# EAGLE design MySens-easyESP32b-007c (EAGLE 7.7.0)
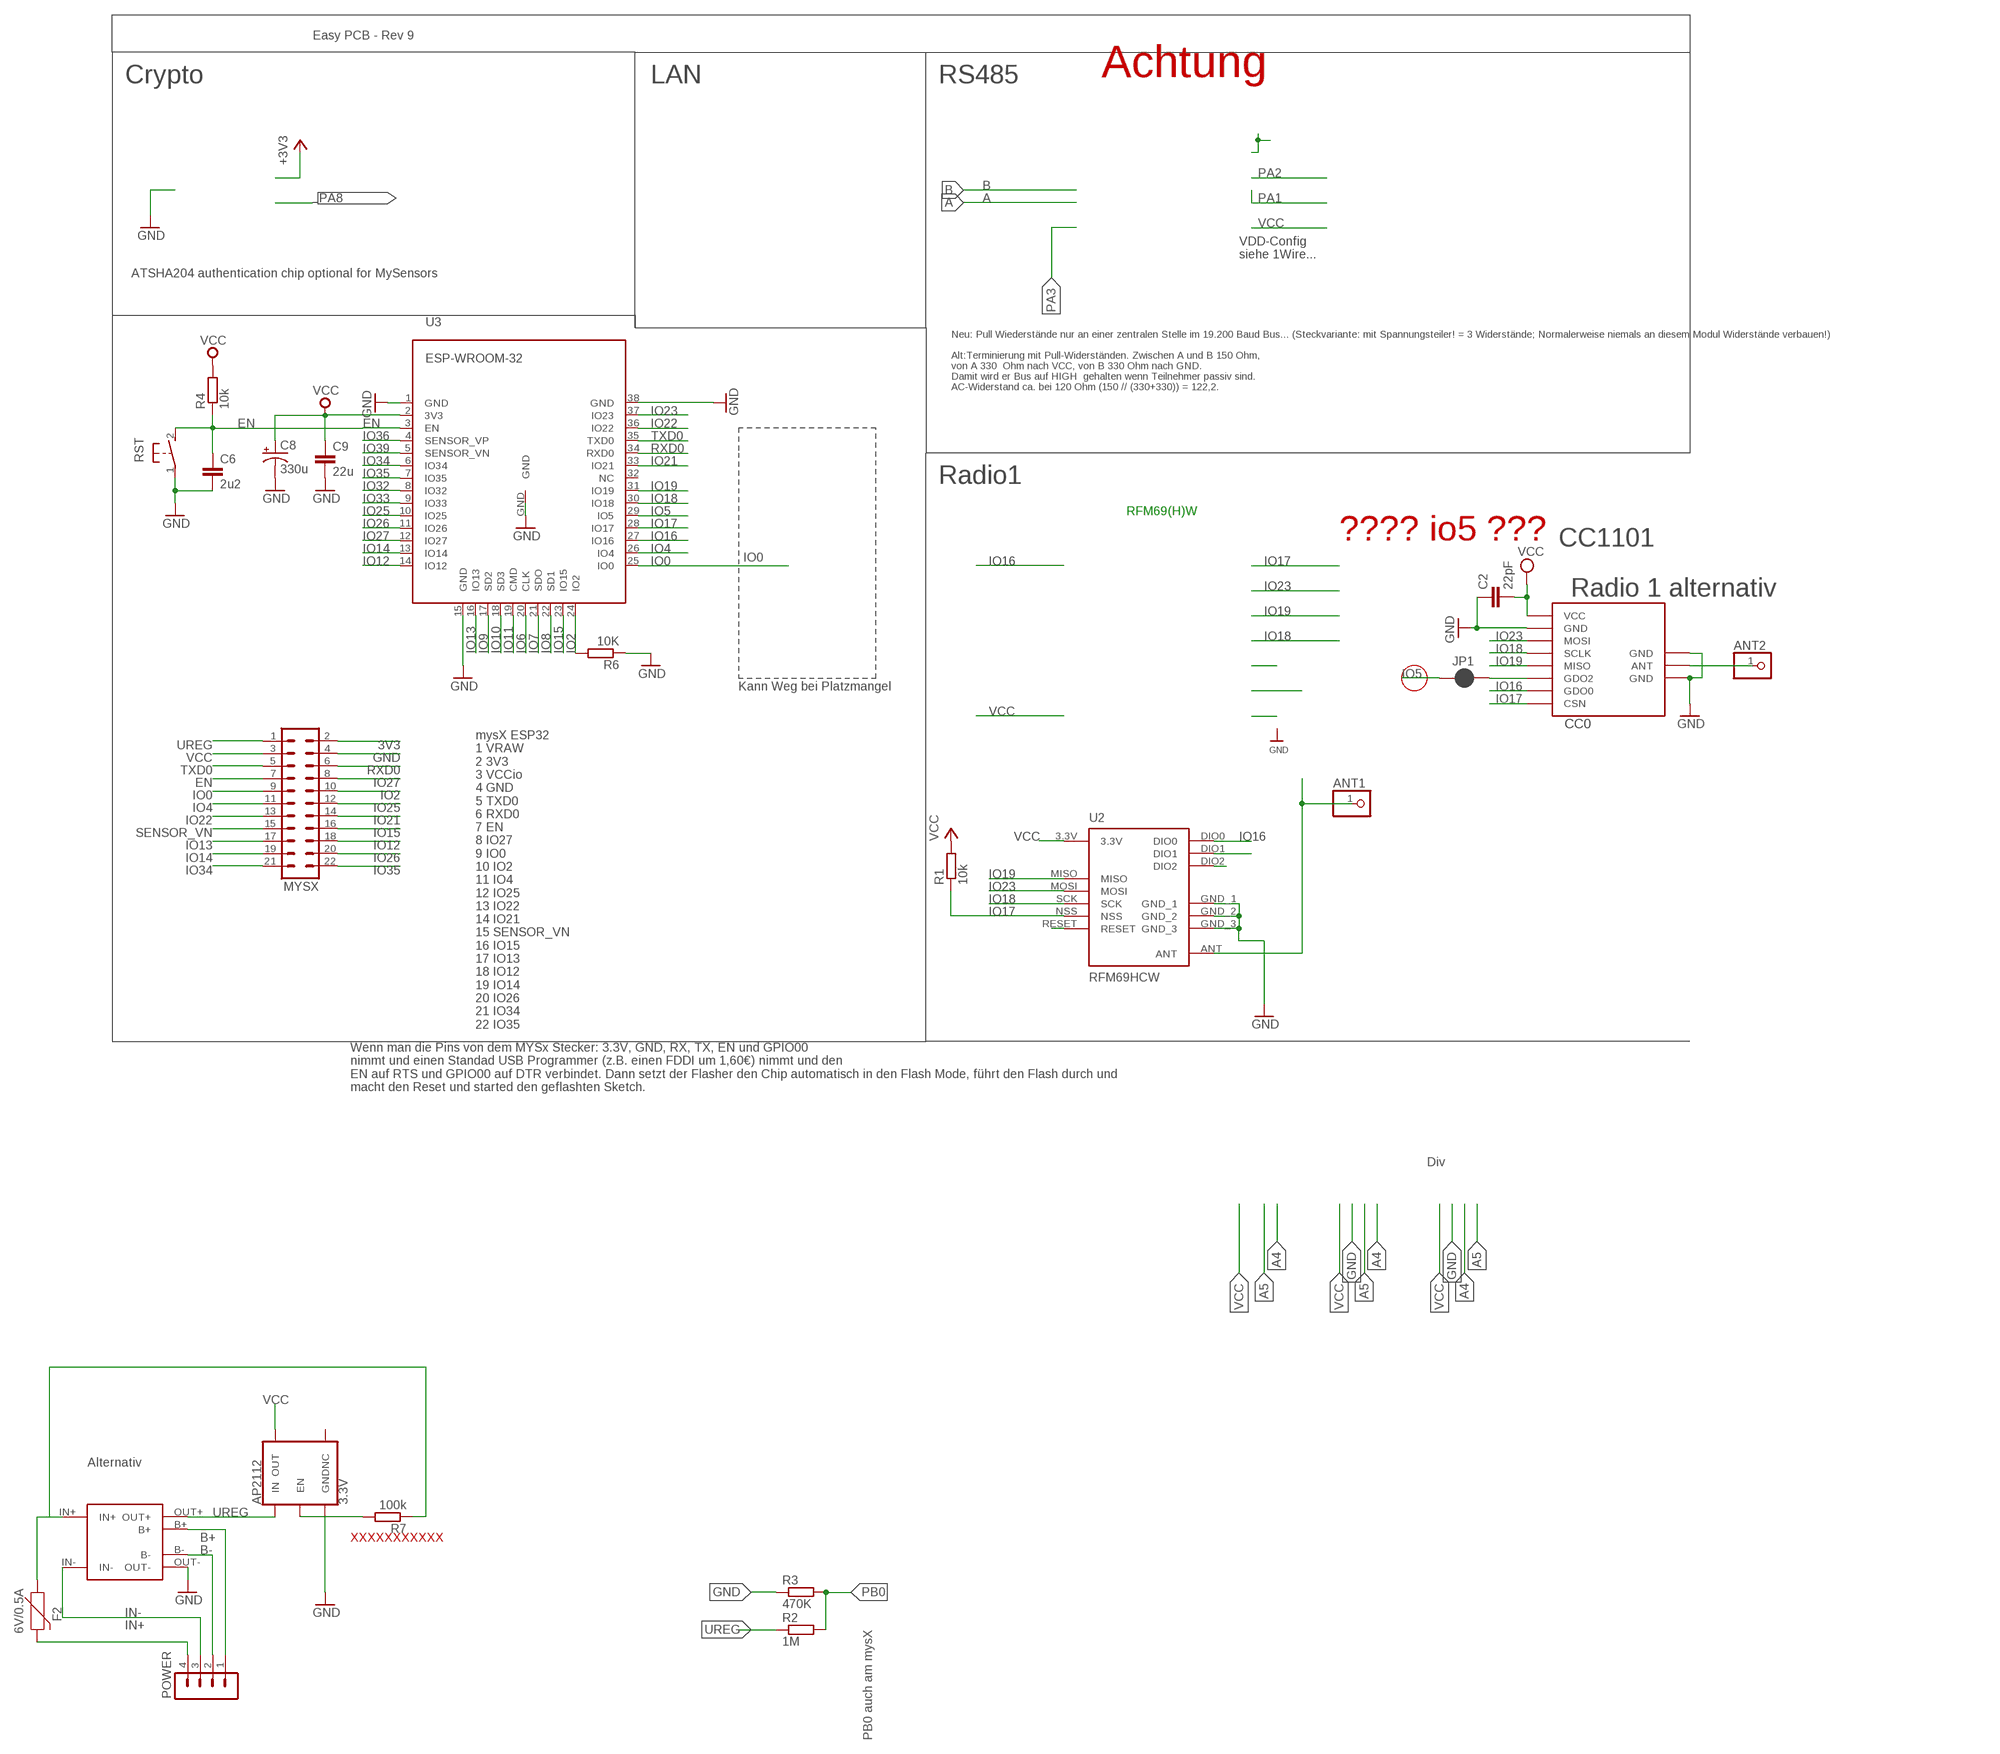
[diagram p0: schematic, sheet 1]

## Parts
ANT1  PINHD-1X1  [1X01]
ANT2  PINHD-1X1  [1X01]
AP2112  3.3V  V_REG_AP2112K-3.3V  [SOT23-5]
C2  22pF  C-EUC0805  [C0805]
C6  2u2  C-EUC0805  [C0805]
C8  330u  CAP_POLSMD  [VISHAY_C]
C9  22u  C-EUC0805  [C0805]
CC0  CC1101  CC1101_MODULE1SMD  [CC1101_MODULE1_SMD]
F2  6V/0.5A  PPTC_HALF-AMP  [1206]
JP1  JUMPER-SMT_2_NC_PASTE_NO-SILK  [SMT-JUMPER_2_NC_PASTE_NO-SILK]
MYSX  MA11-2  [MA11-2]
POWER  MA04-1  [MA04-1]
R1  10k  R-EU_M0805  [M0805]
R2  1M  R-EU_M0805  [M0805]
R3  470K  R-EU_M0805  [M0805]
R4  10k  R-EU_M0805  [M0805]
R6  10K  R-EU_M0805  [M0805]
R7  100k  R-EU_M0805  [M0805]
RST  DTSM-3  [DTSM-3]
TP4056  TP4056-MODULE  [TP4056-LITHIUM-PROTECTED-MODULE]
U2  RFM69HCW  [RFM69HCW-XXXS2]
U3  ESP-WROOM-32  [ESP-WROOM-32]

## Nets
3V3: MYSX.2 ; supply symbol labelled +3V3
ANT0: ANT2.1 CC0.ANT
ANT1: ANT1.1 U2.ANT
B+ [vcc]: POWER.1 TP4056.B+
B- [gnd]: POWER.2 TP4056.B-
EN: C6.1 MYSX.7 R4.1 RST.2 U3.3(EN)
GND [gnd]: AP2112.2(GND) C2.1 C6.2 C8.- C9.2 CC0.GND@0(GND) CC0.GND@1(GND) CC0.GND@2(GND) MYSX.4 R3.1 R6.1 RST.1 TP4056.OUT- U2.GND_1 U2.GND_2 U2.GND_3 U3.1(GND) U3.15(GND) U3.38(GND) U3.GND
IN+ [vcc]: F2.2 POWER.4
IN++ [vcc]: F2.1 R7.1 TP4056.IN+
IN- [gnd]: POWER.3 TP4056.IN-
IO0: MYSX.9 U3.25(IO0)
IO2: MYSX.10 R6.2 U3.24(IO2)
IO4: MYSX.11 U3.26(IO4)
IO5: JP1.1 U3.29(IO5)
IO6: U3.20(CLK)
IO7: U3.21(SDO)
IO8: U3.22(SD1)
IO9: U3.17(SD2)
IO10: U3.18(SD3)
IO11: U3.19(CMD)
IO12: MYSX.18 U3.14(IO12)
IO13: MYSX.17 U3.16(IO13)
IO14: MYSX.19 U3.13(IO14)
IO15: MYSX.16 U3.23(IO15)
IO16: CC0.GDO0 U2.DIO0 U3.27(IO16)
IO17: CC0.CSN R1.1 U2.NSS U3.28(IO17)
IO18: CC0.SCLK U2.SCK U3.30(IO18)
IO19: CC0.MISO U2.MISO U3.31(IO19)
IO21: MYSX.14 U3.33(IO21)
IO22: MYSX.13 U3.36(IO22)
IO23: CC0.MOSI U2.MOSI U3.37(IO23)
IO25: MYSX.12 U3.10(IO25)
IO26: MYSX.20 U3.11(IO26)
IO27: MYSX.8 U3.12(IO27)
IO32: U3.8(IO32)
IO33: U3.9(IO33)
IO34: MYSX.21 U3.6(IO34)
IO35: MYSX.22 U3.7(IO35)
IO36: U3.4(SENSOR_VP)
IO39: U3.5(SENSOR_VN)
MAYBE_IO5: CC0.GDO2 JP1.2
N$4: U2.DIO2
N$8: U2.DIO1
N$9: U2.RESET
N$12: AP2112.3(EN) R7.2
PB0: R2.2 R3.2
RXD0: MYSX.6 U3.34(RXD0)
SENSOR_VN: MYSX.15
TXD0: MYSX.5 U3.35(TXD0)
UREG [gnd]: AP2112.1(IN) MYSX.1 R2.1 TP4056.OUT+
VCC [gnd]: AP2112.5(OUT) C2.2 C8.+ C9.1 CC0.VCC MYSX.3 R1.2 R4.2 U2.3.3V U3.2(3V3)
Unconnected: AP2112.4(NC) U3.32(NC)

## Notes on the sheet
- Easy PCB - Rev 9
- Crypto | LAN | RS485 | Achtung
- VDD-Config
  siehe 1Wire...
- ATSHA204 authentication chip optional for MySensors
- Neu: Pull Wiederstände nur an einer zentralen Stelle im 19.200 Baud Bus... (Steckvariante: mit Spannungsteiler! = 3 Widerstände; Normalerweise niemals an diesem Modul Widerstände verbauen!)
  
  Alt:Terminierung mit Pull-Widerständen. Zwischen A und B 150 Ohm,
  von A 330  Ohm nach VCC, von B 330 Ohm nach GND. 
  Damit wird er Bus auf HIGH  gehalten wenn Teilnehmer passiv sind.
  AC-Widerstand ca. bei 120 Ohm (150 // (330+330)) = 122,2.
- Radio1
- RFM69(H)W
- ???? io5 ??? | CC1101
- Radio 1 alternativ
- Kann Weg bei Platzmangel
- mysX ESP32
  1 VRAW
  2 3V3
  3 VCCio
  4 GND
  5 TXD0
  6 RXD0
  7 EN
  8 IO27
  9 IO0
  10 IO2
  11 IO4
  12 IO25
  13 IO22
  14 IO21
  15 SENSOR_VN
  16 IO15
  17 IO13
  18 IO12
  19 IO14
  20 IO26
  21 IO34
  22 IO35
- Wenn man die Pins von dem MYSx Stecker: 3.3V, GND, RX, TX, EN und GPIO00
  nimmt und einen Standad USB Programmer (z.B. einen FDDI um 1,60€) nimmt und den
  EN auf RTS und GPIO00 auf DTR verbindet. Dann setzt der Flasher den Chip automatisch in den Flash Mode, führt den Flash durch und
  macht den Reset und started den geflashten Sketch.
- Div
- Alternativ
- XXXXXXXXXXX
- PB0 auch am mysX

## Library data of the parts
ANT1 ANT2 = pinhead:PINHD-1X1: PIN HEADER
AP2112 = SparkFun-IC-Power:V_REG_AP2112: AP2112 - 600mA CMOS LDO Regulator w/ Enable The AP2112 is CMOS process low dropout linear regulator with enable function, the regulator delivers a guaranteed 600mA (min.) continuous load current. Features Output Voltage Accuracy: ±1.5% Output Current: 600mA (Min.) Foldback Short Current Protection: 50mA Enable Function to Turn ON/OFF VOUT Low Dropout Voltage (3.3V): 250mV (Typ.) @IOUT=600mA Excellent Load Regulation: 0.2%/A (Typ.) Excellent Line Regulation: 0.02%/V (Typ.) Low Quiescent Current: 55μA (Typ.) Low Standby Current: 0.01μA (Typ.) Low Output Noise: 50μVRMS PSRR: 100Hz -65dB, 1kHz -65dB OTSD Protection Stable with 1.0μF Flexible Cap: Ceramic, Tantalum and Aluminum Electrolytic Operation Temperature Range: -40°C to 85°C ESD: MM 400V, HBM 4000V; PROD_ID: VREG-12457
C2 = rcl:C-EU: CAPACITOR, European symbol
C6 C9 = rcl@1:C-EU: CAPACITOR, European symbol; SPICEPREFIX: C
C8 = SparkFun-Passives:CAP_POL: Capacitor Polarized These are standard SMD and PTH capacitors. Normally 10uF, 47uF, and 100uF in electrolytic and tantalum varieties. Always verify the external diameter of the through hole cap, it varies with capacity, voltage, and manufacturer. The EIA devices should be standard.
CC0 = wireless:CC1101_MODULE1: CC1101 wireless module for 433/868 MHz (sold from Aliexpress). DIL version for mounting with pin header (and SMD soldering) and SMD only variant available.
F2 = SparkFun-Fuses:PPTC: Resettable Fuse PPTC Resettable Fuse. Really a sort of resistor with a polymeric positive temperature coefficient whose resistance increases dramatically with an increase in temperature. When heated by the power passing through the resistance rises causing the current to be limited, protecting the circuit. This is achieved by the transition of the polymer from a crystalline to an amorphous state where the conductive carbon separates breaking the conductive pathways found in the cool crystalline structure. When a PPTC cools back down it resumes conducting letting the circuit turn back on. SparkFun Products: SparkFun RedBoard - Programmed with Arduino <https://www.sparkfun.com/products/12757> Pro Micro - 5V/16MHz <https://www.sparkfun.com/products/12640> Arduino Pro 328 - 5V/16MHz <https://www.sparkfun.com/products/10915> MP3 Trigger <https://www.sparkfun.com/products/13720>; PROD_ID: RES-08585
JP1 = SparkFun-Jumpers:JUMPER-SMT_2_NC_PASTE: Normally closed solder jumper This jumper has an aperture in the stencil to allow solder paste to bridge the split in the wire so it's normally closed (NC). Wick off the solder to open the connection. Reapply solder to reclose the connection.
MYSX = con-Pinheader:MA11-2: PIN HEADER; OC_FARNELL: unknown; OC_NEWARK: unknown
POWER = con-lstb:MA04-1: PIN HEADER; OC_FARNELL: unknown; OC_NEWARK: unknown
R1-R3 R6 R7 = rcl:R-EU_: RESISTOR, European symbol
R4 = rcl@1:R-EU_: RESISTOR, European symbol; SPICEPREFIX: R
RST = switch-tact:DTSM-3
TP4056 = tp2112-usw-V2:TP4056-MODULE
U2 = doug:RFM69H
U3 = esp32:ESP-WROOM-32

## Net classes
0 default: width 0.305 mm, clearance 0.205 mm
1 gnd: width 0.457 mm, drill 0.635 mm, clearance 0.254 mm
2 vcc: width 0.406 mm, drill 0.406 mm, clearance 0.254 mm

## Board
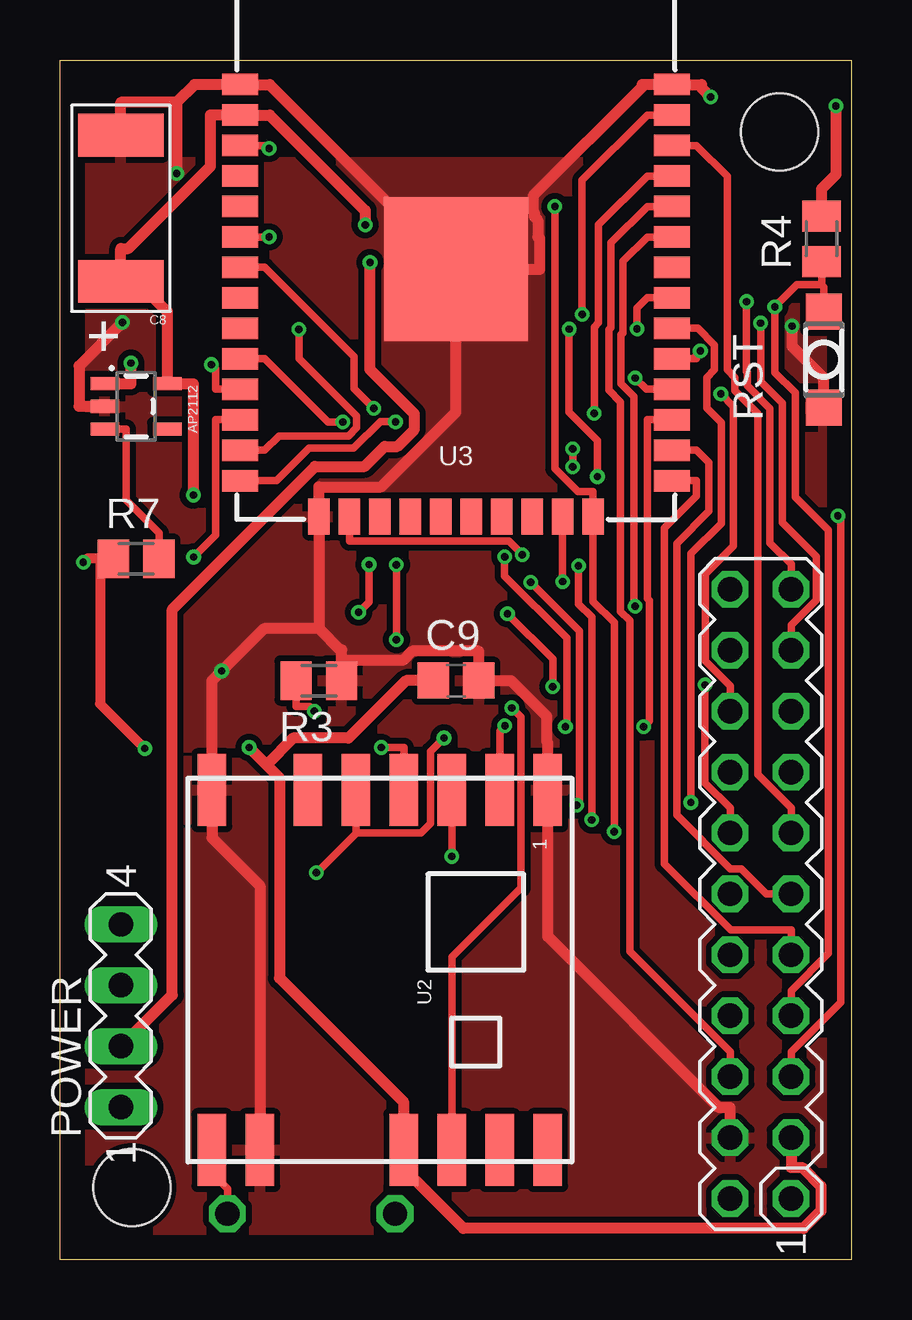
[diagram p1: board, top side]
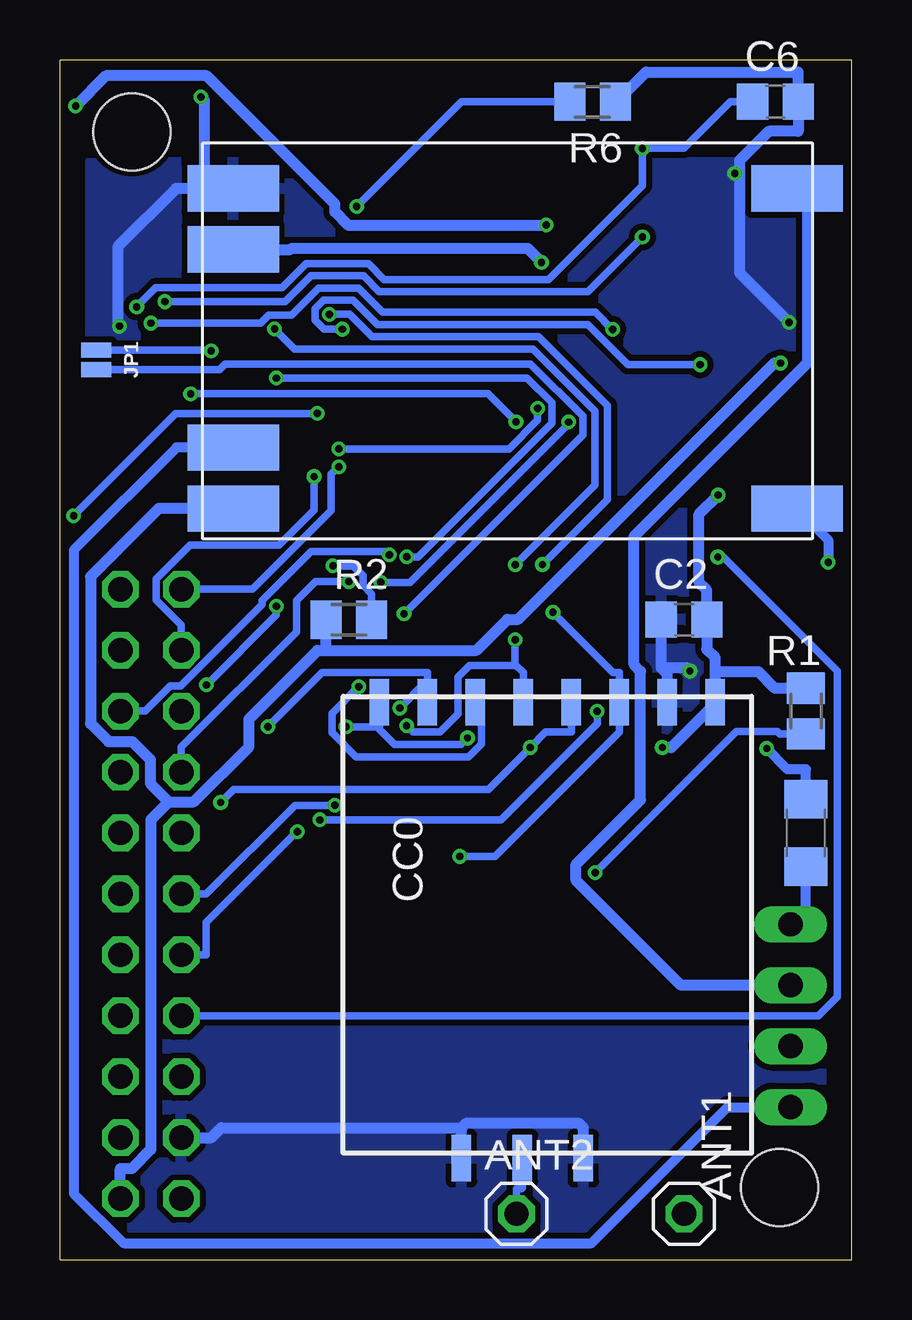
[diagram p2: board, bottom side, seen from below]

Size 33 x 50 mm. Coordinates in mm from the lower left corner, seen from the top.
Outline: 0,0 0,50 33,50 33,0 0,0
Copper layers (1*16): Top 0.035mm / dielectric 1.5mm / Bottom 0.035mm
Design rules "dirt_cheap_dirty_boards.v1": minimum track width 5mil, minimum drill 12mil, track to track 5mil, track to pad 5mil, pad to pad 5mil, via to via 5mil, smd to smd 0mil, copper to edge 10mil, drill to drill 10mil, minimum pad ring 10mil, minimum via ring 6mil, stop-mask expansion 2mil, vias tented up to drill 25mil, thermal gap 10mil
Holes 3.2 mm at 3,3 30,47

### Footprints (pad centres in the part's own frame; a part is rotated, then mirrored left to right if it is on the bottom)
1X01 = drill 1.016 octagon: 1 0,0
SOT23-5 = smd 0.55 x 1.2: 1 -0.95,-1.3; 2 0,-1.3; 3 0.95,-1.3; 4 0.95,1.3; 5 -0.95,1.3
C0805 = smd 1.3 x 1.5: 1 -0.95,0; 2 0.95,0
VISHAY_C = smd 3.556 x 1.778: + 0,3.048; - 0,-3.048
CC1101_MODULE1_SMD = smd 1.93 x 0.813: ANT 19,5.96; CSN 0,0; GDO0 0,2; GDO2 0,4; GND@0 0,12; GND@1 19,8.5; GND@2 19,3.42; MISO 0,6; MOSI 0,10; SCLK 0,8; VCC 0,14
1206 = smd 1.6 x 1.8: 1 -1.4,0; 2 1.4,0
SMT-JUMPER_2_NC_PASTE_NO-SILK = smd 0.635 x 1.27: 1 -0.406,0; 2 0.406,0
MA11-2 = drill 1.016 octagon: 1 -12.7,-1.27; 2 -12.7,1.27; 3 -10.16,-1.27; 4 -10.16,1.27; 5 -7.62,-1.27; 6 -7.62,1.27; 7 -5.08,-1.27; 8 -5.08,1.27; 9 -2.54,-1.27; 10 -2.54,1.27; 11 0,-1.27; 12 0,1.27; 13 2.54,-1.27; 14 2.54,1.27; 15 5.08,-1.27; 16 5.08,1.27; 17 7.62,-1.27; 18 7.62,1.27; 19 10.16,-1.27; 20 10.16,1.27; 21 12.7,-1.27; 22 12.7,1.27
MA04-1 = drill 1.016 long: 1 -3.81,0; 2 -1.27,0; 3 1.27,0; 4 3.81,0
M0805 = smd 1.3 x 1.6: 1 -0.95,0; 2 0.95,0
DTSM-3 = smd 1.5 x 1.5: 1 -2,0; 2 2,0
TP4056-LITHIUM-PROTECTED-MODULE = smd 3.81 x 1.93: B+ 11.43,4.445; B- 11.43,-3.81; IN+ -12.065,6.985; IN- -12.065,-6.35; OUT+ 11.43,6.985; OUT- 11.43,-6.35
RFM69HCW-XXXS2 = smd 3 x 1.2: 3.3V 7.5,1; ANT 7.5,-7; DIO0 7.5,3; DIO1 7.5,5; DIO2 7.5,7; GND_1 7.5,-5; GND_2 -7.5,-7; GND_3 -7.5,7; MISO -7.5,5; MOSI -7.5,3; NSS -7.5,-1; RESET -7.5,-3; SCK -7.5,1
ESP-WROOM-32 = smd 0.9 x 1.5: 1 7.7,9; 2 6.43,9; 3 5.16,9; 4 3.89,9; 5 2.62,9; 6 1.35,9; 7 0.08,9; 8 -1.19,9; 9 -2.46,9; 10 -3.73,9; 11 -5,9; 12 -6.27,9; 13 -7.54,9; 14 -8.81,9; 25 -8.81,-9; 26 -7.54,-9; 27 -6.27,-9; 28 -5,-9; 29 -3.73,-9; 30 -2.46,-9; 31 -1.19,-9; 32 0.08,-9; 33 1.35,-9; 34 2.62,-9; 35 3.89,-9; 36 5.16,-9; 37 6.43,-9; 38 7.7,-9 | smd 1.5 x 0.9: 15 -10.3,5.715; 16 -10.3,4.445; 17 -10.3,3.175; 18 -10.3,1.905; 19 -10.3,0.635; 20 -10.3,-0.635; 21 -10.3,-1.905; 22 -10.3,-3.175; 23 -10.3,-4.445; 24 -10.3,-5.715 | smd 6 x 6: GND 0,0

### Placement (x,y rotation side)
ANT1  6.99,1.91 0 bottom
ANT2  13.97,1.91 0 bottom
AP2112  3.17,35.56 270 top
C2  6.99,26.67 0 bottom
C6  3.17,48.26 0 bottom
C8  2.54,43.81 180 top
C9  16.51,24.13 0 top
CC0  19.68,23.23 270 bottom
F2  1.91,17.78 270 bottom
JP1  31.49,37.5 270 bottom
MYSX  29.21,15.24 90 top
POWER  2.54,10.16 90 top
R1  1.91,22.86 90 bottom
R2  20.95,26.67 0 bottom
R3  10.79,24.13 180 top
R4  31.75,42.55 90 top
R6  10.79,48.26 180 bottom
R7  3.17,29.21 0 top
RST  31.84,37.51 90 top
TP4056  14.35,38.29 180 bottom
U2  13.34,12.06 270 top
U3  16.51,41.27 90 top

### Tracks (layer width: path | path; a pad name or v marks a point on that pad's centre or on a via)
ANT0
  Bottom 0.305: ANT2.1 13.97,2.95 13.76,2.95 13.72,2.98 CC0.ANT
ANT1
  Top 0.305: ANT1.1 6.99,2.95 6.33,3.6 U2.ANT
B+
  Bottom 0.406: TP4056.B+ 28.14,33.84 32.42,29.57 32.42,2.75 30.35,0.68 10.84,0.68 5.17,6.35 POWER.1
B-  (via drill 0.3 pad 0.61)
  Top 0.457: POWER.2 4.68,11.03 4.68,27.1 10.63,33.06 12.71,33.06 13.54,33.89 14.07,33.89 14.78,34.6 14.78,35.25 12.93,37.1 v12.93,41.56
  Bottom 0.457: TP4056.B- 23.39,42.1 23.34,42.15 13.51,42.15 v12.93,41.56
EN  (via drill 0.3 pad 0.61)
  Top 0.305: 31.75,40.63 30.72,40.63 v29.8,39.71 29.8,36.97 30.65,36.13 30.65,31.78 32.03,30.4 32.03,12.76 30.48,11.2 MYSX.7 | U3.3 8.6,46.44 v8.72,46.32 | 31.75,40.63 R4.1 | 31.75,40.63 31.84,40.54 31.84,40.02 RST.2
  Bottom 0.305: v29.8,39.71 29,40.51 23.74,40.51 22.74,41.51 20.14,41.51 19.48,40.85 12.63,40.85 8.72,44.77 v8.72,46.32 7,46.32 5.05,48.26 C6.1
GND  (via drill 0.3 pad 0.61)
  Top 0.457: 16.51,40.3 16.51,35.32 13.39,32.21 10.79,32.21 10.79,31.07 U3.15 10.79,26.3 | 11.74,24.82 11.74,25.41 11.68,25.41 10.79,26.3 | R3.1 11.74,24.82 | 11.74,24.82 11.89,24.97 14.3,24.97 14.69,25.36 17.46,25.36 C9.2 17.57,24.13 18.59,24.13 18.8,24.13 20.29,22.65 20.29,21.6 20.34,21.55 U2.GND_3 20.34,13.46 27.47,6.33 27.94,6.33 MYSX.4 | 10.79,26.3 8.51,26.3 v6.74,24.53 6.33,24.13 U2.GND_2 6.33,17.58 8.34,15.58 U2.GND_1 | v27.12,48.46 26.74,48.83 26.74,48.98 U3.38 24.28,48.98 24.28,48.89 19.73,44.34 19.73,43.68 19.77,43.64 19.77,43.47 19.93,43.32 19.93,42.63 19.99,42.57 19.99,41.27 U3.GND 16.51,40.3 | 4.87,48.23 v4.87,45.27 | 4.87,48.23 5.61,48.98 U3.1 8.74,48.98 16.51,41.21 16.51,40.3 | 4.87,48.23 2.54,48.23 C8.- | AP2112.2 0.79,35.56 0.79,37.25 v2.6,39.06 | v30.52,38.91 30.52,38.07 31.84,36.74 RST.1
  Bottom 0.457: 26.97,44.64 26.97,48.31 v27.12,48.46 | 26.97,44.64 28.16,44.64 30.59,42.21 30.59,38.98 v30.52,38.91 | TP4056.OUT- 26.97,44.64 | 4.67,45.27 4.67,41.13 v2.6,39.06 | 4.67,45.27 4.67,45.8 3.45,47.03 2.23,47.03 C6.2 2.23,49.49 8.57,49.49 9.85,48.22 R6.1 | v4.87,45.27 4.67,45.27 | 7.68,24.41 7.93,24.66 C2.1 | 7.68,24.41 7.68,24.29 CC0.GND@0 | 7.68,24.41 7.68,24.67 6.88,24.67 v6.74,24.53 | 16.27,5.5 16.09,5.67 11.36,5.67 11.19,5.5 CC0.GND@1 | 16.27,5.5 26.28,5.5 26.7,5.08 MYSX.4 | CC0.GND@2 16.27,5.5
  pour Top: 31.75,45.72 1.27,45.72 1.27,1.27 31.75,1.27
  pour Bottom: 1.27,45.72 31.75,45.72 31.75,1.27 1.27,1.27
IN+
  Bottom 0.406: POWER.4 1.91,14.61 F2.2
IN++  (via drill 0.3 pad 0.61)
  Top 0.406: 1.67,29.21 1.67,23.16 v3.54,21.3 | 1.67,29.21 1.12,29.21 v0.97,29.06 | R7.1 1.67,29.21
  Bottom 0.406: v3.54,21.3 2.67,20.44 1.91,20.44 F2.1 | TP4056.IN+ 0.97,30 v0.97,29.06
IN-
  Bottom 0.457: POWER.3 7.11,11.43 11.48,15.79 11.48,16.48 8.8,19.16 8.8,24.52 9.07,24.79 9.07,30.14 1.82,37.39 1.82,44.18 TP4056.IN-
IO0
  Top 0.305: U3.25 26.54,32.47 26.54,31.82 25.2,30.48 25.2,16.5 27.96,13.74 30.48,13.74 MYSX.9
IO2  (via drill 0.3 pad 0.61)
  Top 0.305: v23.11,17.84 23.11,26.55 22.23,27.44 22.23,29.95 22.23,30.46 U3.24 22.23,32 21.59,32 20.63,32.96 v20.63,43.89
  Bottom 0.305: v23.11,17.84 26.9,14.05 26.9,12.7 MYSX.10 | R6.2 16.26,48.26 v20.63,43.89
IO4
  Top 0.305: U3.26 26.54,33.73 27.05,33.22 27.05,31.19 25.71,29.85 25.71,18.52 27.95,16.28 28.4,16.28 29.44,15.24 MYSX.11
IO5  (via drill 0.3 pad 0.61)
  Top 0.305: v26.7,37.87 26.54,37.71 26.54,37.55 U3.29
  Bottom 0.305: JP1.1 26.73,37.91 v26.7,37.87
IO12  (via drill 0.3 pad 0.61)
  Top 0.305: U3.14 9.04,32.47 10.39,33.82 12.25,33.82 13.36,34.92 v13.99,34.92 | v27.55,36.09 28.08,35.56 28.08,29.75 26.9,28.57 26.9,24.94 27.94,23.9 MYSX.18
  Bottom 0.305: v13.99,34.92 15.15,36.09 v27.55,36.09
IO13  (via drill 0.3 pad 0.61)
  Top 0.305: v19.27,29.38 18.71,29.95 12.06,29.95 U3.16
  Bottom 0.305: v19.27,29.38 19.39,29.5 22.54,29.5 24.57,27.47 24.57,27.3 27.96,23.9 28.4,23.9 29.44,22.86 MYSX.17
IO14  (via drill 0.3 pad 0.61)
  Top 0.305: v9.96,38.77 9.96,37.56 12.37,35.15 12.37,34.67 12.03,34.33 9.13,34.33 8.54,33.73 U3.13 | v29.21,39.03 29.21,36.59 30.11,35.69 30.11,30.72 31.52,29.3 31.52,27.49 30.48,26.44 MYSX.19
  Bottom 0.305: v29.21,39.03 24.64,39.03 24.3,39.37 23.35,39.37 22.23,40.49 20.56,40.49 19.55,39.48 10.68,39.48 v9.96,38.77
IO15  (via drill 0.3 pad 0.61)
  Top 0.305: U3.23 v20.95,28.26
  Bottom 0.305: v20.95,28.26 22.35,28.26 23.14,27.47 23.14,26.16 27.94,21.36 MYSX.16
IO16  (via drill 0.3 pad 0.61)
  Top 0.305: v24.34,22.2 24.57,22.44 24.57,27.46 24.48,27.55 24.48,35.01 U3.27 | v18.83,22.99 19.21,22.61 19.21,15.5 16.34,12.62 U2.DIO0
  Bottom 0.305: v24.34,22.2 22.07,24.47 17.68,24.47 17.68,24.03 | 17.68,24.03 17.8,24.03 v18.83,22.99 | CC0.GDO0 17.68,24.03
IO17  (via drill 0.3 pad 0.61)
  Top 0.305: v21.07,22.2 21.14,22.27 21.14,25.9 18.54,28.49 v18.54,29.29 | U3.28 24.45,36.27 v23.98,36.74 | v16.01,21.74 15.46,21.18 15.46,18.18 15.06,17.79 12.34,17.79 | 12.34,17.79 12.34,17.77 v10.69,16.12 | U2.NSS 12.34,17.79
  Bottom 0.305: v18.54,29.29 18.07,29.29 12.5,34.86 12.5,35.72 13.53,36.74 v23.98,36.74 | 19.68,22.2 19.68,22.1 19.05,21.46 16.28,21.46 v16.01,21.74 | CC0.CSN 19.68,22.2 | v21.07,22.2 19.68,22.2 | R1.1 2.98,21.91 3.09,22.01 4.8,22.01 v10.69,16.12
IO18  (via drill 0.3 pad 0.61)
  Top 0.305: U3.30 26.58,38.81 27.28,38.12 27.28,37.08 26.97,36.77 26.97,35.48 27.56,34.89 27.56,30.68 26.3,29.42 v26.3,19.05 | v13.39,21.34 14.34,21.34 U2.SCK
  Bottom 0.305: v26.3,19.05 25.76,19.59 15.14,19.59 v13.39,21.34 12.76,21.98 11.69,21.98 CC0.SCLK
IO19  (via drill 0.3 pad 0.61)
  Top 0.305: v24.05,38.79 24.05,39.66 24.48,40.09 U3.31 | v14.03,28.95 v14.03,25.84 | v18.55,22.25 18.34,22.03 U2.MISO
  Bottom 0.305: v24.05,38.79 23.22,37.95 13.27,37.95 10.69,35.37 10.69,32.29 v14.03,28.95 | v14.03,25.84 14.03,24.81 | 14.03,24.81 14.09,24.75 15.93,24.75 16.41,24.27 16.41,22.74 17.16,21.98 18.28,21.98 v18.55,22.25 | 14.03,24.81 13.69,24.47 CC0.MISO
IO21  (via drill 0.3 pad 0.61)
  Top 0.305: v23.98,27.23 23.93,27.28 23.93,35.97 23.39,36.5 23.39,38.55 23.47,38.62 23.47,41.62 24.48,42.62 U3.33 | v26.89,23.95 26.89,19.87 27.94,18.82 MYSX.14
  Bottom 0.305: v26.89,23.95 23.98,26.86 v23.98,27.23
IO22
  Top 0.305: MYSX.13 30.48,18.82 29.09,20.21 29.09,35.27 28.14,36.22 28.14,36.77 27.82,37.09 27.82,45.16 26.54,46.44 U3.36
IO23  (via drill 0.3 pad 0.61)
  Top 0.305: v21.77,39.4 21.77,44.99 24.48,47.7 U3.37 | v16.34,16.8 16.34,17.79 U2.MOSI | v12.88,28.97 12.88,27.41 v12.45,26.98
  Bottom 0.305: v21.77,39.4 20.93,39.4 19.99,38.46 13.06,38.46 10.18,35.58 10.18,31.67 v12.88,28.97 | v16.34,16.8 14.86,16.8 9.69,21.98 9.69,22.6 CC0.MOSI 9.69,24.47 9.94,24.47 v12.45,26.98
IO25  (via drill 0.3 pad 0.61)
  Top 0.305: v19.63,28.23 21.66,26.2 21.66,19.05 v21.55,18.94 | v11.79,34.91 11.18,34.91 8.54,37.55 U3.10
  Bottom 0.305: v21.55,18.94 23.2,18.94 26.9,15.24 MYSX.12 | v19.63,28.23 18.4,28.23 11.79,34.84 v11.79,34.91
IO26  (via drill 0.3 pad 0.61)
  Top 0.305: v22.4,32.64 22.4,34.14 21.23,35.32 v21.23,38.78 | v6.32,37.3 6.48,37.14 6.48,36.27 U3.11
  Bottom 0.305: v6.32,37.3 9.32,37.3 11,38.97 19.76,38.97 20.77,39.98 22.01,39.98 22.36,39.64 22.36,39.15 21.98,38.78 v21.23,38.78 | v22.4,32.64 22.4,31.23 23.86,29.78 27.57,29.78 28.98,28.37 28.98,27.48 27.94,26.44 MYSX.20
IO27  (via drill 0.3 pad 0.61)
  Top 0.305: v5.57,29.28 6.48,30.19 6.48,35.01 U3.12
  Bottom 0.305: v5.57,29.28 5.35,29.28 0.6,24.53 0.6,10.95 1.39,10.16 MYSX.8
IO34  (via drill 0.3 pad 0.61)
  Top 0.305: v28.62,39.93 28.62,37 28.65,36.98 28.65,36.43 29.6,35.48 29.6,29.86 30.48,28.98 MYSX.21 | U3.6 v8.72,42.62
  Bottom 0.305: v28.62,39.93 23.61,39.93 22.53,41 20.35,41 19.69,40.34 11,40.34 v8.72,42.62
IO35  (via drill 0.3 pad 0.61)
  Top 0.305: v13.08,35.48 12.25,36.31 12.25,37.64 8.54,41.35 U3.7 | v21.38,33.05 v21.38,33.79
  Bottom 0.305: v21.38,33.79 14.29,33.79 13.08,34.99 v13.08,35.48 | v21.38,33.05 21.69,32.74 | 21.69,32.74 | 21.69,32.74 21.69,31.21 24.96,27.94 26.9,27.94 MYSX.22
MAYBE_IO5  (via drill 0.3 pad 0.61)
  Top 0.305: v18.66,26.92 20.55,25.03 v20.55,23.88
  Bottom 0.305: v20.55,23.88 21.66,22.76 21.66,21.96 20.65,20.95 15.96,20.95 15.42,21.49 15.42,22.96 CC0.GDO2 | JP1.2 26.35,37.09 26.11,37.33 13.38,37.33 11.2,35.15 11.2,34.37 v18.66,26.92
N$12
  Top 0.305: AP2112.3 2.75,34.61 2.75,31.66 4.12,30.29 R7.2
PB0  (via drill 0.3 pad 0.61)
  Top 0.305: v22.17,18.33 22.17,26.77 21.62,27.32 v21.62,28.91 | R3.2 9.85,23.05 10.41,23.05 v10.6,22.86
  Bottom 0.305: v10.6,22.86 10.6,22.34 14.62,18.33 v22.17,18.33 | v21.62,28.91 20.79,28.91 20.37,28.5 20.37,28.11 20,27.75 R2.2
RXD0
  Top 0.305: MYSX.6 27.94,8.66 23.75,12.85 23.75,26.63 23.37,27.01 23.37,35.74 22.88,36.23 22.88,38.75 22.96,38.84 22.96,42.38 24.48,43.9 U3.34
TXD0  (via drill 0.3 pad 0.61)
  Top 0.305: v22.28,35.27 22.28,38.87 22.45,39.05 22.45,43.13 24.48,45.16 U3.35 | v32.43,31 32.55,30.89 32.55,10.73 30.48,8.66 MYSX.5
  Bottom 0.305: v32.43,31 28.17,35.27 v22.28,35.27
UREG  (via drill 0.3 pad 0.61)
  Top 0.457: v2.96,37.37 2.96,36.51 AP2112.1
  Bottom 0.457: 28.46,19.07 27.42,19.07 25.12,21.37 25.12,22.53 22.27,25.39 21.91,25.39 | 21.91,25.39 15.64,25.39 14.35,26.68 13.9,26.68 3.22,37.37 v2.96,37.37 | 21.91,25.39 R2.1 | TP4056.OUT+ 28.88,31.3 31.73,28.46 31.73,22.34 30.98,21.59 29.98,21.59 29.23,20.84 29.23,19.85 28.46,19.07 | 28.46,19.07 29.21,18.33 29.21,4.58 30.01,3.79 30.48,3.79 MYSX.1
VCC  (via drill 0.3 pad 0.61)
  Top 0.457: R4.2 31.75,44.63 32.35,45.23 v32.35,48.08 | v12.72,43.13 12.72,43.72 8.74,47.7 U3.2 6.89,47.7 6.28,47.7 6.28,45.57 2.84,42.14 2.54,42.14 2.54,41.45 | 8.61,20.62 9.15,20.08 9.15,11.73 14.34,6.55 U2.3.3V 14.34,3.78 16.82,1.29 31,1.29 31.73,2.02 31.73,3.05 30.95,3.83 30.48,3.83 MYSX.3 | v7.88,21.34 8.61,20.62 | 8.61,20.62 9.71,21.73 12.03,21.73 14.43,24.13 C9.1 | v5.56,31.87 5.56,36.51 AP2112.5 4.47,39.52 2.54,41.45 | C8.+ 2.54,41.45
  Bottom 0.457: v12.72,43.13 12.75,43.1 20.96,43.1 21.53,43.67 21.53,43.99 26.88,49.34 31.09,49.34 v32.35,48.08 | v7.88,21.34 7.51,21.34 5.68,23.17 CC0.VCC 5.68,23.86 5.68,24.5 | v5.56,31.87 6.36,31.07 6.36,28.23 6.04,27.9 C2.2 6.04,26.05 6.04,25.44 5.68,25.09 5.68,24.5 | 5.68,24.5 3.87,24.5 3.19,23.81 R1.2

### Text on the board
tNames: easyGW BluePill 0.2 / RS485, RFM69, RFM95 | VCC | GND | SDL | SDA | 5V | UREG | GND | 5V
bNames: PluepillGW V01 / RS485, RFM69, RFM95
Document: DS_1551K